# EasyEDA Pro project PBMCU_C_Hall.epro, board PCB1_1
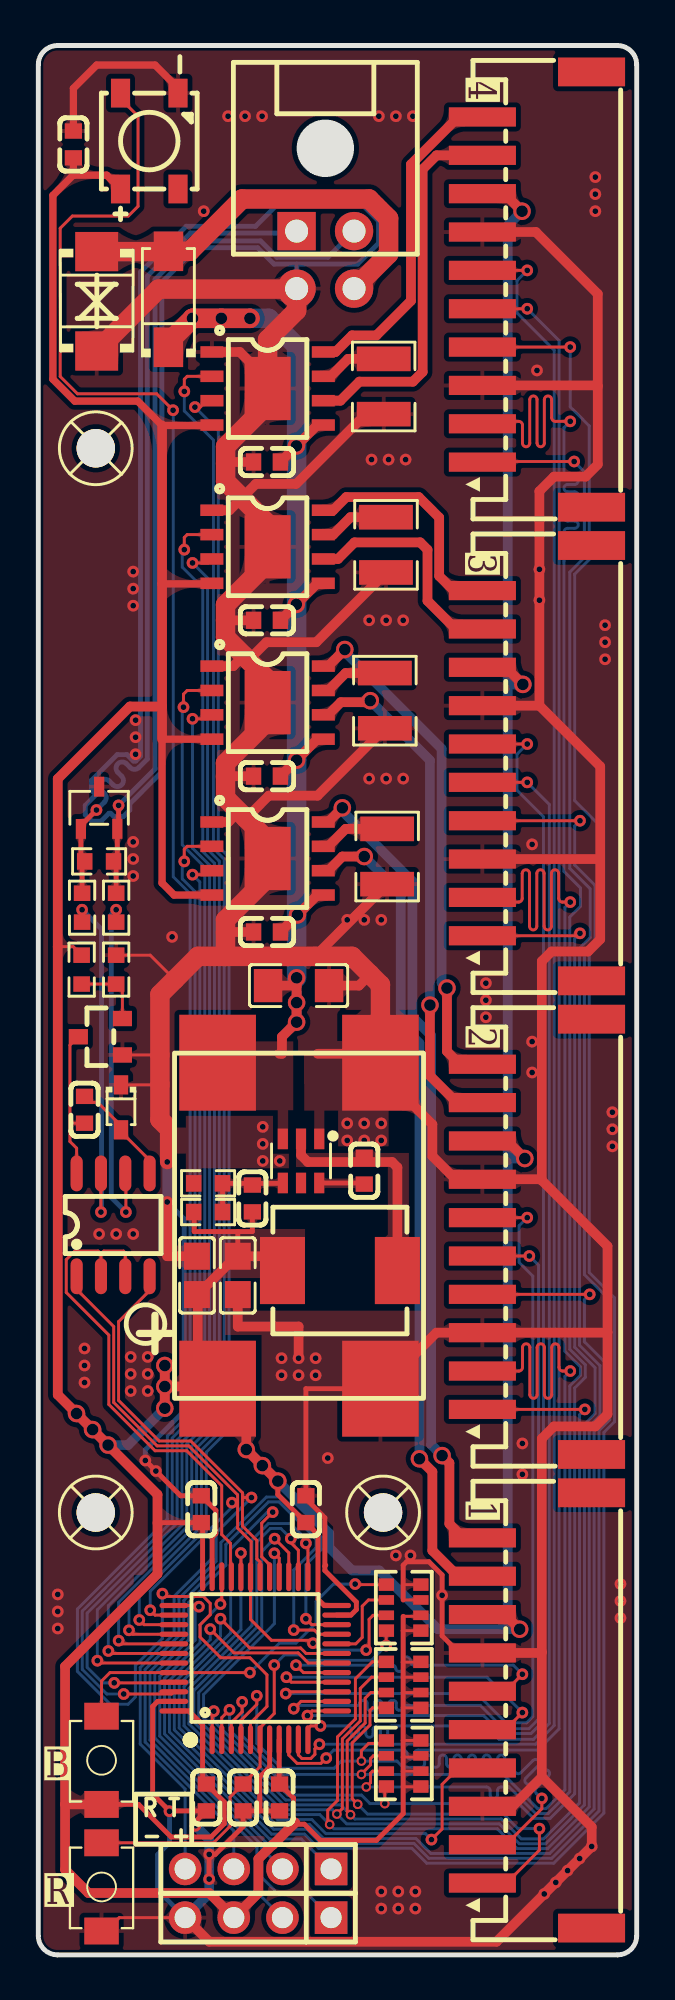
[diagram p2: board, top side]
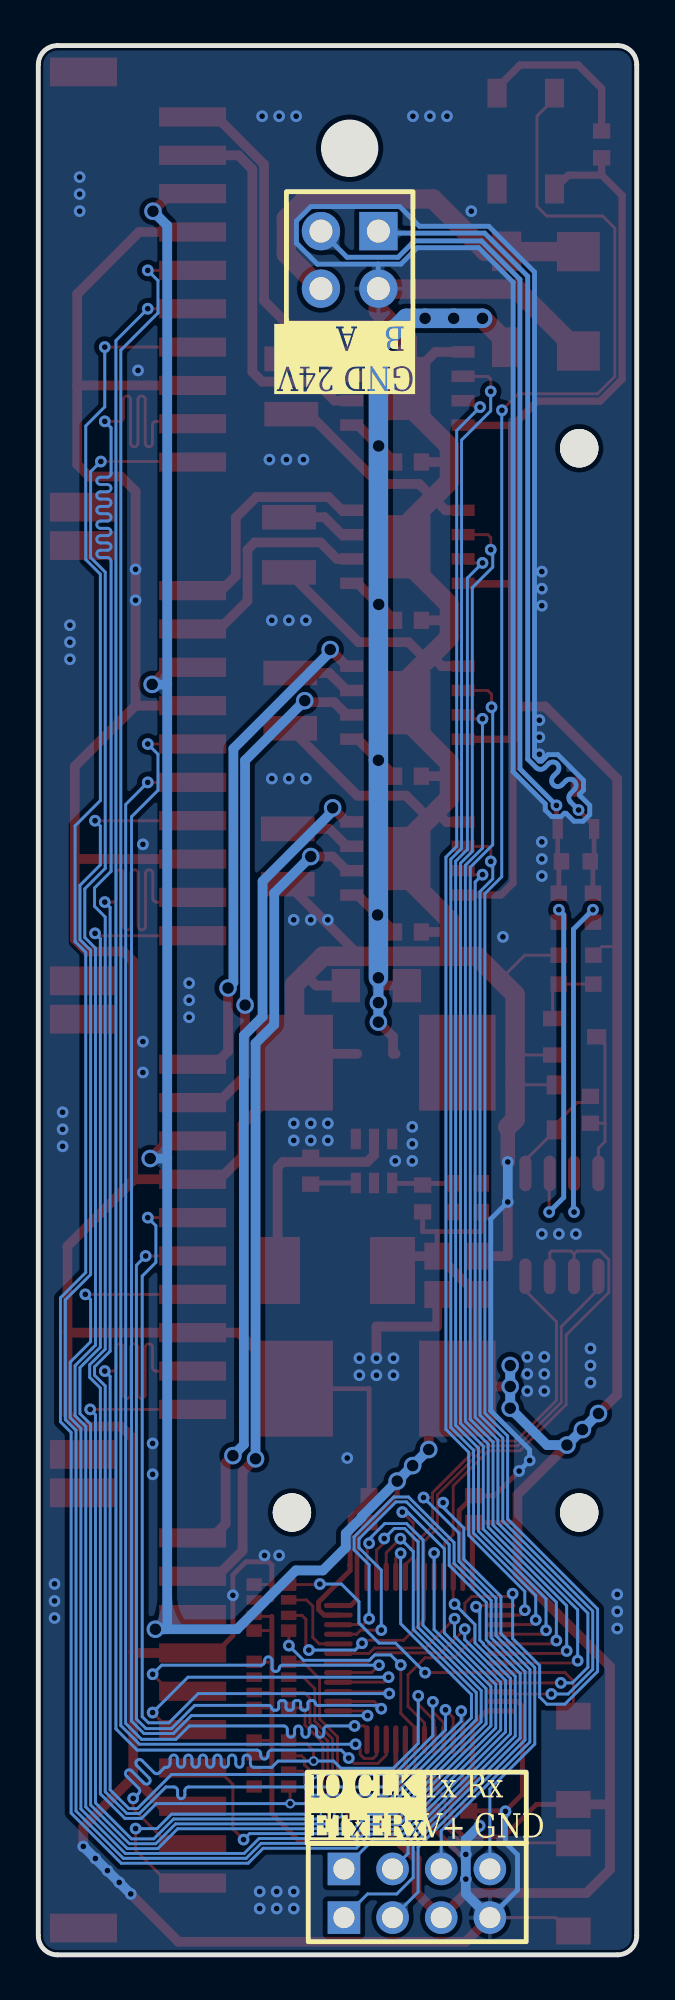
[diagram p3: board, bottom side, seen from below]

Outline 31.24 x 99.57 mm; copper layers: Top Layer, Bottom Layer. Coordinates in mm from the lower left corner of the outline.
Outline path: 0,98.57 0,1 arc(0.29,0.29) 1,0 30.24,0 arc(30.95,0.29) 31.24,1 31.24,98.57 arc(30.95,99.28) 30.24,99.57 1,99.57 arc(0.29,99.28) 0,98.57
Stack: Top Layer 0.035mm / Dielectric1 1.51mm FR4 er 4.5 / Bottom Layer 0.035mm

## Design rules (mm)
net RS485_B: RS485
net RS485_A: RS485
template: 自定义配置
spacing copperThickness1oz (default): track to track 0.102, other pairs 0 to 0.3
spacing copperThickness2oz: track to track 0.203, other pairs 0.152 to 0.3
track width copperThickness1oz (default): min 0.127, default 0.254, max 2.54
track width copperThickness2oz: min 0.203, default 0.254, max 2.54
differential pair differentialPair (default): width min 0.127, default 0.254, max 2.54; gap min 0.152, default 0.152
via viaSize (default): diameter min 0.5, default 0.61, max 10; hole min 0.3, default 0.305, max 6.3

## Placement (name value [footprint] x y rotation side)
C1  47pF  [C0603]  11.18 39.45 270 top
C2  22uF  [C1206]  13.59 50.55 180 top
C3  22uF  [C0805]  8.28 35.43 270 top
C4  22uF  [C0805]  10.41 35.43 90 top
C5  100nF  [C0603]  17.02 40.89 90 top
C6  100nF  [C0603]  10.69 8.21 90 top
C7  100nF  [C0603]  12.6 8.21 90 top
C8  100nF  [C0603]  8.77 8.21 90 top
C9  100nF  [C0603]  13.97 23.24 270 top
C10  100nF  [C0603]  8.51 23.24 270 top
C11  100nF  [C0603]  1.83 94.41 270 top
C13  100nF  [C0603]  11.94 77.85 0 top
C14  100nF  [C0603]  11.94 61.47 0 top
C15  100nF  [C0603]  11.94 69.6 0 top
C16  100nF  [C0603]  11.94 53.34 0 top
C17  100nF  [C0603]  2.41 44.07 270 top
CN1  HC-MX3.0-2*2AW  [CONN-TH_4P-P3.00_HC-MX3.0-2X2AW_1]  14.99 88.39 180 top
CN2  2.0-10P WT  [CONN-SMD_10P-P2.00_2.0-10P-WT]  26.03 86.85 90 top
CN3  2.0-10P WT  [CONN-SMD_10P-P2.00_2.0-10P-WT]  26.03 62.15 90 top
CN4  2.0-10P WT  [CONN-SMD_10P-P2.00_2.0-10P-WT]  26.03 37.45 90 top
CN5  2.0-10P WT  [CONN-SMD_10P-P2.00_2.0-10P-WT]  26.03 12.75 90 top
D1  SMBJ24CA  [SMB_L4.6-W3.6-LS5.3-BI]  3.05 86.23 90 top
D2  PSM712-LF-T7  [SOT-23-3_L3.0-W1.7-P0.95-LS2.9-BR]  3.18 59.82 270 top
D3  1N5819WS  [SOD-323_L1.8-W1.3-LS2.5-RD]  4.32 44.2 270 top
D4  SS54  [SMA_L4.4-W2.8-LS5.4-R-RD]  6.79 86.34 90 top
H1  -  [HDR-TH_4P-P2.54-V-M]  11.48 1.94 180 top
H2  -  [HDR-TH_4P-P2.54-V-M]  11.48 4.48 180 top
L1  10uH  [IND-SMD_L7.3-W6.8]  15.75 35.69 180 top
LED1  XL-5050RGBC-WS2812B  [LED-SMD_4P-L5.0-W5.0-BL_XL-5050RGBC]  5.79 94.59 0 top
Q1  AO3401A  [SOT-23_L2.9-W1.3-P1.90-LS2.4-BR]  3.24 47.88 0 top
R1  68kΩ  [R0603]  8.86 38.74 180 top
R2  15kΩ  [R0603]  8.86 40.23 0 top
R3  680mΩ  [R1210]  18.03 81.79 270 top
R4  680mΩ  [R1210]  18.15 73.53 270 top
R5  680mΩ  [R1210]  18.09 65.41 270 top
R6  680mΩ  [R1210]  18.21 57.28 270 top
R7  10Ω  [R0603]  2.29 54.61 90 top
R8  10Ω  [R0603]  4.06 54.61 90 top
R9  120Ω  [R0603]  3.18 57.02 180 top
R10  470Ω  [R0603]  4.06 51.38 270 top
R11  10Ω  [R0603]  2.26 51.38 270 top
RN1  10kΩ  [RES-ARRAY-SMD_0603-8P-L3.2-W1.6-BL]  19.07 9.98 270 top
RN2  10kΩ  [RES-ARRAY-SMD_0603-8P-L3.2-W1.6-BL]  19.07 14.08 270 top
RN3  10kΩ  [RES-ARRAY-SMD_0603-8P-L3.2-W1.6-BL]  19.07 18.11 270 top
SW1  B3U-1000P  [KEY-SMD_B3U-1000PM]  3.3 3.56 270 top
SW2  B3U-1000P  [KEY-SMD_B3U-1000PM]  3.3 10.16 270 top
TP1  -  [M2螺丝]  3 78.57 0 top
TP2  -  [M2螺丝]  3 23.07 0 top
TP3  -  [M2螺丝]  18 23.07 0 top
U1  TPS54202DDCR  [SOT-23-6_L2.9-W1.6-P0.95-LS2.8-BL]  13.72 41.4 180 top
U2  CH32V203C8T6  [LQFP-48_L7.0-W7.0-P0.50-LS9.0-BL]  11.33 15.47 0 top
U3  -  [SMD 方焊盘 4*5]  9.36 29.53 180 top
U4  -  [SMD 方焊盘 4*5]  9.36 46.53 180 top
U5  -  [SMD 方焊盘 4*5]  17.86 46.53 0 top
U6  -  [SMD 方焊盘 4*5]  17.86 29.53 0 top
U7  TP75176E-SR  [SOP-8_L4.9-W3.9-P1.27-LS6.0-BL]  3.91 38.07 0 top
U8  AT8236  [ESOP-8_L4.9-W3.9-P1.27-LS6.0-BL-EP]  11.97 81.68 270 top
U9  AT8236  [ESOP-8_L4.9-W3.9-P1.27-LS6.0-BL-EP]  11.97 73.43 270 top
U10  AT8236  [ESOP-8_L4.9-W3.9-P1.27-LS6.0-BL-EP]  11.97 65.3 270 top
U11  AT8236  [ESOP-8_L4.9-W3.9-P1.27-LS6.0-BL-EP]  11.97 57.17 270 top

## Footprints (pads in the part's own frame, mm; a bottom-side part is the same pattern mirrored in y, then rotated)
C0603
  rect 0.8x0.9 smd: 1(-0.7,0) 2(0.7,0)
C0805
  rect 1.41x1.35 smd: 1(-1,0) 2(1,0)
C1206
  rect 1.485x1.728 smd: 1(-1.593,0) 2(1.593,0)
CONN-SMD_10P-P2.00_2.0-10P-WT
  rect 1x3.5 smd: 1(-9,2.85) 2(-7,2.85) 3(-5,2.85) 4(-3,2.85) 5(-1,2.85) 6(1,2.85) 7(3,2.85) 8(5,2.85) 9(7,2.85) 10(9,2.85)
  rect 1.5x3.5 smd: 11(11.35,-2.85) 12(-11.35,-2.85)
CONN-TH_4P-P3.00_HC-MX3.0-2X2AW_1
  rect 2x2 hole 1.2: 1(1.5,-1.5)
  round 2 hole 1.2: 2(1.5,1.5) 3(-1.5,-1.5) 4(-1.5,1.5)
ESOP-8_L4.9-W3.9-P1.27-LS6.0-BL-EP
  rect 0.6x1.2 smd: 1(-1.905,-2.909) 2(-0.635,-2.909) 3(0.635,-2.909) 4(1.905,-2.909) 5(1.905,2.909) 6(0.635,2.909) 7(-0.635,2.909) 8(-1.905,2.909)
  rect 3.3x2.4 smd: 9(0,0)
HDR-TH_4P-P2.54-V-M
  rect 1.7x1.7 hole 1.1: 1(-3.81,0)
  round 1.7 hole 1.1: 2(-1.27,0) 3(1.27,0) 4(3.81,0)
IND-SMD_L7.3-W6.8
  rect 2.35x3.5 smd: 1(-3,0) 2(3,0)
KEY-SMD_B3U-1000PM
  rect 1.4x1.8 smd: 1(-2.286,0) 2(2.314,0)
LED-SMD_4P-L5.0-W5.0-BL_XL-5050RGBC
  rect 1x1.5 smd: 1(-1.5,-2.5) 2(1.5,-2.5) 3(1.5,2.5) 4(-1.5,2.5)
LQFP-48_L7.0-W7.0-P0.50-LS9.0-BL
  oval 0.27x1.5 smd: 1(-2.75,-4.25) 2(-2.25,-4.25) 3(-1.75,-4.25) 4(-1.25,-4.25) 5(-0.75,-4.25) 6(-0.25,-4.25) 7(0.25,-4.25) 8(0.75,-4.25) 9(1.25,-4.25) 10(1.75,-4.25) 11(2.25,-4.25) 12(2.75,-4.25) 25(2.75,4.25) 26(2.25,4.25) 27(1.75,4.25) 28(1.25,4.25) 29(0.75,4.25) 30(0.25,4.25) 31(-0.25,4.25) 32(-0.75,4.25) 33(-1.25,4.25) 34(-1.75,4.25) 35(-2.25,4.25) 36(-2.75,4.25)
  oval 1.5x0.27 smd: 13(4.25,-2.75) 14(4.25,-2.25) 15(4.25,-1.75) 16(4.25,-1.25) 17(4.25,-0.75) 18(4.25,-0.25) 19(4.25,0.25) 20(4.25,0.75) 21(4.25,1.25) 22(4.25,1.75) 23(4.25,2.25) 24(4.25,2.75) 37(-4.25,2.75) 38(-4.25,2.25) 39(-4.25,1.75) 40(-4.25,1.25) 41(-4.25,0.75) 42(-4.25,0.25) 43(-4.25,-0.25) 44(-4.25,-0.75) 45(-4.25,-1.25) 46(-4.25,-1.75) 47(-4.25,-2.25) 48(-4.25,-2.75)
M2螺丝
  round 2 hole 2: 1(0,0)
R0603
  rect 0.806x0.864 smd: 1(-0.753,0) 2(0.753,0)
R1210
  rect 1.282x2.808 smd: 1(-1.441,0) 2(1.441,0)
RES-ARRAY-SMD_0603-8P-L3.2-W1.6-BL
  rect 0.65x0.8 smd: 1(-1.2,-0.9) 4(1.2,-0.9) 5(1.2,0.9) 8(-1.2,0.9)
  rect 0.5x0.8 smd: 2(-0.4,-0.9) 3(0.4,-0.9) 6(0.4,0.9) 7(-0.4,0.9)
SMA_L4.4-W2.8-LS5.4-R-RD
  rect 2.062x1.539 smd: 1(2.503,0) 2(-2.503,0)
SMB_L4.6-W3.6-LS5.3-BI
  rect 2.047x2.241 smd: 1(-2.591,0) 2(2.591,0)
SMD 方焊盘 4*5
  rect 4x5 smd: 1(0,0)
SOD-323_L1.8-W1.3-LS2.5-RD
  rect 1x0.75 smd: 1(-1.173,0) 2(1.173,0)
SOP-8_L4.9-W3.9-P1.27-LS6.0-BL
  oval 0.63x1.865 smd: 1(-1.905,-2.683) 2(-0.635,-2.683) 3(0.635,-2.683) 4(1.905,-2.683) 5(1.905,2.683) 6(0.635,2.683) 7(-0.635,2.683) 8(-1.905,2.683)
SOT-23-3_L3.0-W1.7-P0.95-LS2.9-BR
  rect 1.038x0.532 smd: 1(1.101,-0.95) 2(1.101,0.95) 3(-1.101,0)
SOT-23-6_L2.9-W1.6-P0.95-LS2.8-BL
  rect 0.532x1.072 smd: 1(-0.95,-1.149) 2(0,-1.149) 3(0.95,-1.149) 4(0.95,1.149) 5(0,1.149) 6(-0.95,1.149)
SOT-23_L2.9-W1.3-P1.90-LS2.4-BR
  rect 1x0.8 smd: 1(1.15,-0.95) 2(1.15,0.95) 3(-1.15,0)

## Nets
As in the schematic.

Pads without a net: CN2 11 12; CN3 11 12; CN4 11 12; CN5 11 12; LED1 2; TP1 1; TP2 1; TP3 1; U1 5

## Via types
v1: diameter 0.914, hole 0.61, Top Layer to Bottom Layer, 28 vias
v2: diameter 1.016, hole 0.61, Top Layer to Bottom Layer, 3 vias
v3: diameter 0.61, hole 0.305, Top Layer to Bottom Layer, 182 vias
v4: diameter 0.5, hole 0.3, Top Layer to Bottom Layer, 8 vias

## Routing (per net, layer and track width the routed paths; a pad name or vN(x,y) marks a point on that pad's centre or on a via; arc(x,y) is an arc through that point)
3.3V: length 344.3
  Top Layer w0.152: R11.1 1.82,52.58 1.02,52.58 ; 19.97,9.58 19.05,9.58 19.05,9.58 ; RN1.5 19.96,8.76 19.05,8.76 ; 19.05,11.18 19.05,11.18 19.97,11.18 ; RN3.6 19.92,17.65 19.05,17.65 ; RN3.5 19.05,16.91 19.05,16.9 ; 19.05,15.27 19.96,15.27 RN2.8 ; RN2.5 19.07,12.88 19.05,12.9 ; 1.4,7.85 1.4,7.84 ; RN2.6 19.07,13.68 19.05,13.66 ; RN2.7 19.09,14.48 19.05,14.44 ; 19.05,10.31 19.91,10.31 RN1.7
  Top Layer w0.254: 6.22,22.53 6.23,22.54 C10.2 8.58,22.47 U2.36 ; v1(12.5,24.71) 12.5,24.01 C9.2 14.6,21.91 14.6,18.54 14.93,18.22 U2.24 ; U2.48 7.86,12.72 8.58,12 U2.1 8.58,9.1 C8.2 9.71,7.97 9.71,6.84 9.02,6.15 6.93,6.15 5.24,7.85 SW2.2 ; 8.14,38.74 8.14,37.72 11.18,37.72 11.18,38.67 ; 19.05,17.65 19.05,7.37 17.65,5.97 14.73,5.97 13.89,6.81 13.33,6.81 13.33,8.18 C7.2 12.58,8.93 U2.9 ; C4.2 10.41,37.72
  Top Layer w0.381: C11.2 1.83,92.82 1.82,92.81 ; 1.82,92.81 0.76,91.75 0.76,82.17 1.91,81.03 5.19,81.03 6.46,79.76 9.04,79.76 U8.4 ; 1.82,92.81 3.57,92.81 4.29,92.09 ; U9.4 9.03,71.5 6.46,71.5 ; U10.4 6.46,63.4 6.46,63.39 6.46,55.9 7.09,55.27 U11.4
  Top Layer w0.508: 8.71,29.64 8.83,29.53 U3.1 ; 8.71,29.64 8.33,30.03 8.33,34.43 10.33,36.43 C4.2 12.75,36.43 L1.2 ; 8.71,29.64 9.25,29.64 U3.1 ; 8.71,29.64 v1(6.6,29.64) ; CN5.8 24.37,17.75 v1(25.13,16.98) ; SW2.2 1.4,7.85 ; 6.46,65.1 4.79,65.1 1.02,61.33 1.02,29.21 v1(2,28.23) v1(2.83,27.39) v1(3.64,26.59) 6.22,24 6.22,19.87 1.4,15.04 1.4,4.45 2.62,3.22 8.92,3.22 H1.3 11.49,3.22 11.49,5 12.23,5.74 12.25,5.74 13.42,6.9 ; 6.46,65.1 6.46,79.76 ; 6.46,65.1 6.46,63.39 ; v1(25.4,41.53) 24.48,42.45 CN4.8 ; CN3.8 24.41,67.15 v1(25.3,66.25) ; U3.1 10.86,28.03 v1(10.86,26.35) v1(11.7,25.51) v1(12.5,24.71) ; v1(25.26,90.93) 24.34,91.85 23.29,91.85 ; v1(6.6,30.73) v1(6.6,29.64) ; v1(6.6,29.64) v1(6.6,28.51)
  Bottom Layer w0.508: 24.51,41.59 24.51,66.24 ; 24.51,41.59 24.51,16.98 ; 24.51,41.59 24.57,41.53 v1(25.4,41.53) ; 24.51,66.24 24.51,90.18 v1(25.26,90.93) ; 24.51,66.24 25.29,66.24 v1(25.3,66.25) ; 24.51,16.98 20.87,16.98 17.8,20.05 16.38,20.05 15.19,21.24 15.19,21.98 14.35,22.82 14.35,22.86 v1(12.5,24.71) v1(11.7,25.51) v1(10.86,26.35) ; 24.51,16.98 v1(25.13,16.98) ; v1(2,28.23) v1(2.83,27.39) v1(3.64,26.59) 4.68,26.59 v1(6.6,28.51) v1(6.6,29.64) v1(6.6,30.73)
24V: length 64.4
  Top Layer w0.508: 12.59,46.99 12.72,46.99 12.72,47.88 v1(13.49,48.64) v1(13.49,49.66) 13.49,50.55 ; C13.2 v1(13.47,78.69) 14.57,79.78 U8.5 ; C16.2 v1(13.53,54.23) 14.57,55.27 U11.5 ; 14.88,71.52 14.57,71.52 v1(13.47,70.43) C15.2 ; 13.49,50.55 v1(13.49,50.95) ; 13.49,50.55 C2.2 ; U10.5 14.57,63.4 12.64,61.47
  Top Layer w1.016: v2(11.05,85.34) v2(9.56,85.34) v2(8.05,85.34) 6.79,84.09 D4.2
  Bottom Layer w0.508: v1(13.49,50.95) v1(13.49,49.66) v1(13.49,48.64)
  Bottom Layer w1.016: v1(13.49,50.95) v1(13.49,62.3) 13.49,83.89 12.03,85.34 v2(11.05,85.34) v2(9.56,85.34) v2(8.05,85.34)
GND: length 517.7
  Top Layer w0.152: D3.1 6.33,45.37 6.35,45.39 ; Q1.1 6.33,46.93 6.35,46.91 ; 7.12,50.85 5.84,52.13 R10.1 ; RN3.7 19.05,18.51 ; 19.05,19.31 RN3.8 ; H1.4 4.23,1.94 3.53,1.24 SW1.2
  Top Layer w0.254: U2.47 6.23,13.22 5.97,12.95 5.97,8.38 6.84,7.51 C8.1 8.2,6.94 v3(8.2,6.73) ; v3(5.59,25.78) v3(6.14,25.23) 7.43,23.94 C10.1 9.27,23.18 9.27,21.97 9.08,21.78 U2.35 ; 14.96,20.27 14.96,20.04 16.61,18.4 16.61,18 16.32,17.72 U2.23 ; 14.96,20.27 14.96,22.79 13.97,23.79 C9.1 13.97,29.53 U6.1 ; 14.96,20.27 15.01,20.32 ; U2.8 12.08,9.79 11.56,9.27 11.56,7.51 ; CN5.7 21.97,15.75 21.08,16.64 v3(21.08,18.75) 21.08,19.81 20.39,20.5 19.23,20.5 19.05,20.32 19.05,18.51 ; v3(8.92,3.95) v3(8.92,5.24) 9.24,5.24 10.69,6.69 C6.1 11.56,7.51 ; 11.56,7.51 C7.1
  Top Layer w0.381: LED1.3 7.29,97.36 6.1,98.55 3.05,98.55 1.83,97.34 C11.1
  Top Layer w0.508: 29.34,57.07 29.34,61.98 26.17,65.15 26.16,65.15 ; 29.34,57.07 29.26,57.15 CN3.3 ; 29.34,57.07 29.34,52.96 28.7,52.32 26.8,52.32 26.29,51.82 26.29,40.39 ; 29.72,32.47 29.7,32.45 CN4.3 20.78,32.45 U6.1 ; 29.72,32.47 29.72,36.96 26.29,40.39 ; 29.72,32.47 29.72,28.19 29.08,27.56 26.92,27.56 26.29,26.92 26.29,15.78 ; R3.2 17.1,80.35 13.46,76.71 11.35,76.71 9.98,75.33 U9.1 ; 26.29,9.27 28.89,6.67 v3(28.89,5.65) v3(28.26,5.02) v3(27.63,4.39) v3(27.02,3.78) v3(26.42,3.18) 23.93,0.68 8.92,0.68 H1.4 ; 26.29,9.27 24.76,7.75 CN5.3 ; 26.29,9.27 26.29,15.78 ; U10.1 10.18,67.21 10.73,67.76 ; 29.21,81.8 29.21,77.72 28.57,77.09 26.92,77.09 26.16,76.33 v3(26.16,72.26) v3(26.16,70.64) 26.16,65.15 ; 29.21,81.8 29.17,81.85 CN2.3 ; 29.21,81.8 29.21,86.61 25.98,89.85 CN2.7 ; 10.97,67.52 11.91,68.45 14.51,68.45 R4.2 ; 26.29,15.78 26.25,15.75 CN5.7 ; C16.1 9.81,53.34 9.77,53.3 ; 11.97,82.13 10.52,83.59 U8.1 ; 10.29,59.44 9.93,59.08 U11.1 ; R6.2 14.45,52.07 ; R5.2 14.58,60.45 12.03,60.45 10.84,59.26 ; 26.16,65.15 CN3.7 ; v3(13.59,31.12) 13.59,32.77 10.41,32.77 C4.1 ; 26.29,40.39 26.23,40.45 CN4.7 21.78,40.45 20.57,41.66 20.57,43.31 17.86,46.02 U5.1 17.4,46.99 14.59,46.99 ; C14.1 9.79,61.47 9.78,61.45 ; 8.33,36.43 6.73,36.43 v3(6.73,39.26) ; 9.78,77.76 9.87,77.85 C13.1 ; C15.1 9.78,69.6 ; C2.1 16.74,50.55 17.32,51.13
  Top Layer w0.762: 6.73,43.18 v3(6.73,41.35)
  Top Layer w1.016: 6.73,43.18 6.35,43.56 6.35,50.08 7.12,50.85 8.34,52.07 9.77,52.07 ; D1.1 6.27,86.87 13.46,86.87 CN1.2 13.49,85.75 11.97,84.24 U8.9 11.97,80.85 9.78,78.66 9.78,76.84 11.97,74.64 U9.9 11.97,72.6 9.78,70.41 9.78,68.71 11.97,66.52 11.97,64.34 9.78,62.15 9.78,60.33 11.97,58.14 11.97,56.16 9.77,53.97 9.77,52.07 ; U5.1 17.86,50.59 16.38,52.07 9.77,52.07
  Bottom Layer w0.254: 4.85,62.37 4.96,62.26 5.09,62.26 5.33,62.5 5.33,87.76 7.72,90.15 11.34,90.15 12.37,91.17 17.02,91.17 17.76,90.42 17.76,89.27 16.67,88.17 13.5,88.17 ; H1.4 6.22,3.38 6.22,5.22 6.85,5.85 ; v3(6.85,7.49) 6.85,5.85 ; 6.85,5.85 6.86,5.84 ; 13.5,88.17 13.5,86.9 CN1.2 ; 13.5,88.17 12.31,88.17 11.45,89.03 8.25,89.03 6.45,87.22 6.45,61.7 4.78,60.02 4.78,59.7 4.43,59.36 3.95,59.36 3.78,59.53 3.69,59.53 3.28,59.12 2.79,59.12 2.45,59.46 2.45,59.94 2.99,60.49 2.99,60.52 2.78,60.74 2.78,61.25 4.12,62.59 4.63,62.59 4.85,62.37 ; v3(6.14,25.23) v3(5.59,25.78) 5.59,26.34 7.62,28.37 7.62,38.37 v3(6.73,39.26)
  Bottom Layer w0.508: v3(28.89,5.65) v3(28.26,5.02) v3(27.63,4.39) v3(27.02,3.78) v3(26.42,3.18) ; v3(8.2,6.73) 8.92,6.01 v3(8.92,5.24) v3(8.92,3.95) 8.92,3.2 H1.4 ; v3(6.73,41.35) v3(6.73,39.26)
  vias: v3(1.02,18.8) v3(1.02,17.91) v3(1.02,17.02) v3(2.41,31.62) v3(2.41,30.73) v3(2.41,29.84) v3(3.18,37.59) v3(4.06,37.59) v3(4.82,31.18) v3(4.82,30.29) v3(4.82,29.4) v3(4.95,72.14) v3(4.95,71.25) v3(4.95,70.36) v3(4.95,58.04) v3(4.95,57.15) v3(4.95,56.26) v3(4.95,37.59) v3(5.08,64.39) v3(5.08,63.5) v3(5.08,62.61) v3(5.71,31.18) v3(5.71,30.29) v3(5.71,29.4) v3(6.99,53.09) v3(8.64,90.93) v3(9.91,95.89) v3(10.79,95.89) v3(11.68,95.89) v3(11.72,43.18) v3(11.72,42.29) v3(11.72,41.4) v3(12.61,41.4) v3(12.7,31.12) v3(12.7,30.23) v3(13.59,30.23) v3(14.48,31.12) v3(14.48,30.23) v3(15.11,25.91) v3(16.13,53.98) v3(16.13,43.36) v3(16.13,42.47) v3(17.02,53.98) v3(17.02,43.36) v3(17.02,42.47) v3(17.27,69.6) v3(17.27,61.34) v3(17.4,77.98) v3(17.78,95.89) v3(17.91,53.98) v3(17.9,43.36) v3(17.9,42.47) v3(17.91,3.3) v3(17.91,2.41) v3(18.16,69.6) v3(18.16,61.34) v3(18.29,77.98) v3(18.67,95.89) v3(18.67,20.83) v3(18.8,3.3) v3(18.8,2.41) v3(19.05,69.6) v3(19.05,61.34) v3(19.18,77.98) v3(19.43,20.83) v3(19.56,95.89) v3(19.69,3.3) v3(19.69,2.41) v3(23.37,50.67) v3(23.37,49.78) v3(23.37,48.9) v3(25.27,26.67) v3(25.27,25.06) v3(25.78,57.91) v3(25.78,47.63) v3(25.78,46.01) v3(26.03,82.63) v3(29.08,92.71) v3(29.08,91.82) v3(29.08,90.93) v3(29.59,69.34) v3(29.59,68.45) v3(29.59,67.56) v3(29.97,43.94) v3(29.97,43.05) v3(29.97,42.16) v3(30.4,19.34) v3(30.4,18.45) v3(30.4,17.57)
BOOT0: length 19.5
  Top Layer w0.152: RN3.1 16.57,19.31 v3(16.54,19.34) ; SW2.1 3.3,14.28 3.74,14.72 U2.44 v3(11.05,14.72)
  Bottom Layer w0.152: v3(16.54,19.34) 15.41,19.34 14.5,18.43 14.5,17.31 13.45,16.26 12.59,16.26 v3(11.05,14.72)
BOOT1: length 4.5
  Top Layer w0.152: U2.20 16.57,16.22 16.91,16.56 16.91,18.18 17.24,18.51 RN3.2
EXIT_RX: length 37.4
  Top Layer w0.152: v3(13.97,17.53) 14.28,17.22 U2.22
  Bottom Layer w0.152: H1.2 11.41,3.27 11.41,5.62 5.83,11.2 5.83,14.77 7.6,16.54 7.6,18.48 9.54,20.42 9.54,21.5 11.91,23.88 12.68,23.88 14.76,21.8 14.76,21.14 14.73,21.11 14.73,21.1 13.97,20.34 v3(13.97,17.53)
EXIT_TX: length 39.7
  Top Layer w0.152: v3(13.34,16.94) 14.41,16.94 14.63,16.72 U2.21
  Bottom Layer w0.152: H1.1 14.05,3.18 12.53,3.18 11.67,4.03 11.67,5.73 6.08,11.31 6.08,14.67 7.85,16.44 7.85,18.38 9.79,20.32 9.79,21.4 12.02,23.62 12.57,23.62 14.48,21.72 14.48,21.71 14.5,21.68 14.5,21.24 14.48,21.22 14.48,21.21 13.34,20.07 v3(13.34,16.94)
K_ONLINE1: length 94.4
  Top Layer w0.152: CN2.6 v3(25.53,87.85) ; U2.11 13.58,10.43 13.76,10.24 14.23,10.24 14.44,10.45 14.44,10.75 v3(14.68,10.98)
  Bottom Layer w0.152: v3(25.53,87.85) 24.99,87.31 24.99,85.62 26.93,83.68 26.93,11.96 25.96,10.98 14.68,10.98
K_ONLINE2: length 68.7
  Top Layer w0.152: CN3.6 v3(25.53,63.15) ; U2.13 14.29,12.72 v3(14.05,12.48)
  Bottom Layer w0.152: v3(14.05,12.48) 23.25,12.48 24.19,11.54 25.73,11.54 26.38,12.19 26.38,59.35 24.99,60.73 24.99,62.61 v3(25.53,63.15)
K_ONLINE3: length 45.2
  Top Layer w0.152: CN4.6 v3(25.53,38.45) ; v3(12.92,13.62) 13.01,13.72 U2.15
  Bottom Layer w0.152: v3(12.92,13.62) 22.89,13.62 24.42,12.1 25.49,12.1 25.82,12.42 25.82,35.4 25.1,36.11 25.1,38.02 v3(25.53,38.45)
K_ONLINE4: length 17.8
  Top Layer w0.152: U2.17 13.84,14.72 v3(13.46,15.11) ; CN5.6 24.38,13.75 v3(25.27,14.63)
  Bottom Layer w0.152: v3(13.46,15.11) 18.5,15.11 arc(18.62,15.06) 18.66,14.94 arc(18.71,14.83) 18.82,14.78 18.88,14.78 arc(19,14.83) 19.04,14.94 19.04,15.35 arc(19.23,15.54) 19.42,15.35 19.42,15.3 arc(19.48,15.16) 19.61,15.11 24.8,15.11 v3(25.27,14.63)
K_PULL1: length 93.6
  Top Layer w0.152: CN2.5 v3(25.53,85.85) ; U2.10 13.08,10.42 13.51,9.99 14.76,9.99 v3(15.03,10.26)
  Bottom Layer w0.152: v3(25.53,85.85) 27.19,84.18 27.19,11.78 26.08,10.68 19.82,10.68 arc(19.69,10.62) 19.63,10.49 19.63,10.4 arc(19.44,10.2) 19.25,10.4 19.25,10.49 arc(19.19,10.62) 19.06,10.68 15.42,10.68 15.03,10.29 v3(15.03,10.26)
K_PULL2: length 68.4
  Top Layer w0.152: CN3.5 v3(25.53,61.15) ; U2.12 14.08,11.79 14.22,11.94 v3(14.73,11.94)
  Bottom Layer w0.152: v3(25.53,61.15) 26.68,59.99 26.68,12.07 25.85,11.24 24.06,11.24 23.36,11.94 18.43,11.94 arc(18.3,11.88) 18.24,11.75 18.24,11.53 arc(18.05,11.34) 17.86,11.53 17.86,11.75 arc(17.67,11.94) 17.48,11.75 17.48,11.53 arc(17.29,11.34) 17.1,11.53 17.1,11.75 arc(16.91,11.94) 16.72,11.75 16.72,11.53 arc(16.53,11.34) 16.34,11.53 16.34,11.75 arc(16.28,11.88) 16.15,11.94 v3(14.73,11.94)
K_PULL3: length 44.9
  Top Layer w0.152: 23.29,36.45 v3(25.64,36.45) ; v3(13.34,12.84) 13.72,13.22 U2.14
  Bottom Layer w0.152: v3(13.34,12.84) 13.51,13.01 16.66,13.01 arc(16.75,13.05) 16.78,13.13 arc(16.82,13.22) 16.91,13.26 17.04,13.26 arc(17.13,13.22) 17.17,13.13 17.17,12.89 arc(17.2,12.8) 17.29,12.76 17.42,12.76 arc(17.51,12.8) 17.55,12.89 17.55,13.13 arc(17.58,13.22) 17.67,13.26 17.8,13.26 arc(17.89,13.22) 17.93,13.13 17.93,12.89 arc(17.96,12.8) 18.05,12.76 18.18,12.76 arc(18.27,12.8) 18.31,12.89 18.31,13.13 arc(18.34,13.22) 18.43,13.26 18.57,13.26 arc(18.65,13.22) 18.69,13.13 18.69,12.89 arc(18.73,12.8) 18.81,12.76 18.95,12.76 arc(19.03,12.8) 19.07,12.89 arc(19.11,12.97) 19.19,13.01 23.08,13.01 24.29,11.8 25.62,11.8 26.12,12.3 26.12,35.96 v3(25.64,36.45)
K_PULL4: length 18.3
  Top Layer w0.152: CN5.5 24.38,11.75 v3(25.27,12.63) ; U2.16 13.21,14.22 v3(12.95,14.48)
  Bottom Layer w0.152: v3(12.95,14.48) 23.43,14.48 v3(25.27,12.63)
MCU_RTS: length 26.9
  Top Layer w0.152: U7.3 4.54,36.61 4.44,36.7 3.42,36.7 3.27,36.55 ; 3.27,36.55 U7.2 ; 3.27,36.55 3.12,36.7 1.91,36.7 1.46,36.26 1.46,34.54 3.68,32.32 3.68,28.7 6.1,26.29 7.75,26.29 9.58,24.46 9.58,21.92 10.03,21.46 10.03,19.76 U2.33
MCU_RX: length 54.4
  Top Layer w0.152: v3(17.12,15.89) 17.27,16.05 17.27,17.5 17.48,17.71 RN3.3 ; v3(10.11,23.58) 10.41,23.58 ; 10.41,23.58 10.41,22.26 11.11,21.55 11.11,19.75 U2.31 11.08,17.5 12.17,16.4 14.19,16.4 v3(14.34,16.25) ; 10.41,23.58 10.41,23.99 7.85,26.54 6.2,26.54 3.94,28.81 3.94,32.77 2,34.7 U7.1
  Bottom Layer w0.152: v3(14.34,16.25) 14.7,15.89 v3(17.12,15.89) ; H2.4 7.67,8.65 5.32,10.99 5.32,14.98 7.09,16.75 7.09,18.69 9.03,20.63 9.03,22.26 10.11,23.34 v3(10.11,23.58)
MCU_SCL1: length 128
  Top Layer w0.152: RN2.1 17.44,15.28 16.56,14.4 16.56,12.3 15.62,11.37 15.62,8.05 15.11,7.54 15.11,6.9 v4(15.21,6.8) ; CN2.1 23.22,77.88 v3(27.98,77.88) ; v3(13.97,21.46) 14.08,21.36 U2.25
  Bottom Layer w0.152: v3(13.97,21.46) 13.97,21.68 13.16,22.49 12.01,22.49 11.16,21.63 11.16,17.18 7.87,13.89 7.87,12.05 12.6,7.31 14.7,7.31 v4(15.21,6.8) 15.44,6.58 23.97,6.58 25,5.54 26.59,5.54 28.76,7.71 28.76,27.56 29.32,28.12 29.32,30.73 28.26,31.79 28.26,52.49 28.81,53.05 28.81,55.59 27.75,56.66 27.75,72.11 28.51,72.87 28.51,77.34 v3(27.98,77.88)
MCU_SCL2: length 99.1
  Top Layer w0.152: CN3.1 28.15,53.15 v3(28.28,53.27) ; v3(13.18,21.71) 13.18,21.5 13.58,21.1 U2.26 ; v4(15.59,7.34) 15.87,7.63 15.87,11.26 16.81,12.2 16.81,13.89 17.4,14.48 RN2.2
  Bottom Layer w0.152: v3(28.28,53.27) 28,52.99 28,31.69 29.07,30.62 29.07,28.22 28.51,27.67 28.51,7.82 26.49,5.8 25.11,5.8 24.07,6.83 16.1,6.83 v4(15.59,7.34) 15.36,7.57 12.7,7.57 8.12,12.15 8.12,13.78 11.41,17.07 11.41,21.53 12.12,22.24 12.66,22.24 v3(13.18,21.71)
MCU_SCL3: length 70.4
  Top Layer w0.152: v3(12.34,21.7) 13.08,20.96 U2.27 ; RN2.3 17.36,13.68 17.06,13.38 17.06,12.09 16.13,11.15 16.13,7.48 v4(16.3,7.31) ; CN4.1 v3(28.53,28.45)
  Bottom Layer w0.152: v3(12.34,21.7) 12.11,21.47 12.1,21.47 11.79,21.16 11.79,21.16 11.66,21.03 11.66,16.97 8.37,13.68 8.37,12.26 12.81,7.82 15.79,7.82 v4(16.3,7.31) 16.52,7.09 24.18,7.09 25.21,6.05 26.38,6.05 28.26,7.92 28.26,28.17 v3(28.53,28.45)
MCU_SCL4: length 42.5
  Top Layer w0.152: v4(16.68,7.85) 16.39,8.14 16.39,11.05 17.32,11.98 17.32,12.75 17.45,12.88 RN2.4 ; CN5.1 24.45,3.75 26.16,5.46 v3(26.16,6.58) ; v3(12.32,20.94) 12.58,20.69 U2.28
  Bottom Layer w0.152: v3(26.16,6.58) 25.04,6.58 24.28,7.34 17.19,7.34 v4(16.68,7.85) 16.45,8.08 12.91,8.08 8.63,12.36 8.63,13.57 12.32,17.27 v3(12.32,20.94)
MCU_SDA1: length 118.7
  Top Layer w0.152: RN1.4 18.09,8.7 v4(18.09,7.89) ; v3(9.16,12.71) 9.08,12.63 U2.2 ; v3(27.77,79.97) 26.99,79.97 arc(26.86,80.03) 26.8,80.16 26.8,81.11 arc(26.61,81.3) 26.42,81.11 26.42,78.84 arc(26.23,78.65) 26.04,78.84 26.04,81.11 arc(25.85,81.3) 25.66,81.11 25.66,78.84 arc(25.47,78.65) 25.28,78.84 25.28,79.78 arc(25.22,79.92) 25.09,79.97 23.31,79.97 CN2.2
  Bottom Layer w0.152: v3(27.77,79.97) 27.44,79.64 27.44,77.25 arc(27.5,77.12) 27.63,77.06 28,77.06 arc(28.19,76.87) 28,76.68 27.63,76.68 arc(27.44,76.49) 27.63,76.3 28,76.3 arc(28.19,76.11) 28,75.92 27.63,75.92 arc(27.44,75.73) 27.63,75.54 28,75.54 arc(28.19,75.35) 28,75.16 27.63,75.16 arc(27.44,74.96) 27.63,74.77 28,74.77 arc(28.19,74.58) 28,74.39 27.63,74.39 arc(27.44,74.2) 27.63,74.01 28,74.01 arc(28.19,73.82) 28,73.63 27.63,73.63 arc(27.44,73.44) 27.63,73.25 28,73.25 arc(28.19,73.06) 28,72.87 27.63,72.87 arc(27.5,72.81) 27.44,72.68 27.44,56.5 28.31,55.64 28.31,54.68 27.75,54.12 27.75,31.58 28.56,30.77 28.56,30.12 28,29.56 28,8.4 26.72,7.12 25.86,7.12 25.09,7.89 v4(18.09,7.89) 17.32,7.89 16.87,8.33 13.02,8.33 9.16,12.19 v3(9.16,12.71)
MCU_SDA2: length 92.1
  Top Layer w0.152: 18.17,9.58 17.45,9.58 17.34,9.47 17.34,8.98 v4(17.12,8.76) ; CN3.2 23.43,54.9 25.07,54.9 arc(25.21,54.96) 25.26,55.09 25.26,56.4 arc(25.46,56.59) 25.65,56.4 25.65,53.64 arc(25.84,53.45) 26.03,53.64 26.03,56.4 arc(26.22,56.59) 26.41,56.4 26.41,53.64 arc(26.6,53.45) 26.79,53.64 26.79,56.4 arc(26.98,56.59) 27.17,56.4 27.17,55.09 arc(27.23,54.96) 27.36,54.9 v3(27.77,54.9) ; U2.3 9.58,12.37 v3(9.98,12.78)
  Bottom Layer w0.152: v3(9.98,12.78) 9.98,11.73 12.96,8.76 v4(17.12,8.76) 23.4,8.76 arc(23.53,8.7) 23.59,8.56 23.59,8.33 arc(23.78,8.14) 23.97,8.33 23.97,8.56 arc(24.03,8.7) 24.16,8.76 24.58,8.76 25.96,7.37 26.62,7.37 27.75,8.5 27.75,29.67 28.31,30.22 28.31,30.67 27.49,31.48 27.49,54.62 v3(27.77,54.9)
MCU_SDA3: length 64.5
  Top Layer w0.152: v3(10.64,13.19) 10.64,12.68 10.08,12.11 U2.4 ; v4(16.87,9.41) 16.87,9.43 17.34,9.91 17.34,10.23 17.49,10.38 RN1.2 ; v3(27.77,30.45) 27.38,30.45 arc(27.24,30.5) 27.19,30.64 27.19,31.68 arc(26.99,31.87) 26.8,31.68 26.8,29.21 arc(26.61,29.02) 26.42,29.21 26.42,31.68 arc(26.23,31.87) 26.04,31.68 26.04,29.21 arc(25.85,29.02) 25.66,29.21 25.66,31.68 arc(25.47,31.87) 25.28,31.68 25.28,30.64 arc(25.22,30.5) 25.09,30.45 CN4.2
  Bottom Layer w0.152: v3(27.77,30.45) 27.49,30.17 27.49,8.61 26.51,7.62 26.07,7.62 24.29,9.41 v4(16.87,9.41) 12.66,9.41 10.64,11.43 v3(10.64,13.19)
MCU_SDA4: length 38.2
  Top Layer w0.152: CN5.2 24.41,5.75 26.29,7.62 v3(26.29,8.16) ; U2.5 10.58,12.23 11.41,13.06 v3(11.41,13.51) ; v4(16.87,10.11) 16.87,10.64 17.25,11.03 18.02,11.03 18.17,11.18
  Bottom Layer w0.152: v3(11.41,13.51) 11.41,11.03 12.7,9.73 15.44,9.73 15.82,10.11 v4(16.87,10.11) 18.72,10.11 19.05,9.78 19.98,9.78 arc(20.12,9.83) 20.17,9.97 20.17,10.23 arc(20.36,10.42) 20.55,10.23 20.55,9.97 arc(20.74,9.78) 20.93,9.97 20.93,10.23 arc(21.12,10.42) 21.31,10.23 21.31,9.97 arc(21.5,9.78) 21.69,9.97 21.69,10.23 arc(21.89,10.42) 22.08,10.23 22.08,9.97 arc(22.27,9.78) 22.46,9.97 22.46,10.23 arc(22.65,10.42) 22.84,10.23 22.84,9.97 arc(23.03,9.78) 23.22,9.97 23.22,10.23 arc(23.41,10.42) 23.6,10.23 23.6,9.97 arc(23.79,9.78) 23.98,9.97 23.98,10.23 arc(24.17,10.42) 24.36,10.23 24.36,9.97 arc(24.42,9.83) 24.55,9.78 24.64,9.78 24.92,9.5 arc(25.06,9.44) 25.19,9.5 25.83,10.13 arc(26.1,10.13) 26.1,9.86 25.46,9.23 arc(25.46,8.96) 25.73,8.96 26.37,9.59 arc(26.64,9.59) 26.63,9.32 26,8.69 arc(25.94,8.55) 26,8.42 26.26,8.16 v3(26.29,8.16)
MCU_TX: length 44.4
  Top Layer w0.152: 10.66,23.84 10.66,23.85 v3(11.13,23.85) ; 10.66,23.84 10.66,22.36 11.41,21.61 11.41,20.65 11.58,20.49 U2.30 ; 10.66,23.84 10.66,24.1 7.96,26.8 6.31,26.8 4.19,28.91 4.19,33.02 5.81,34.64 U7.4
  Bottom Layer w0.152: v3(11.13,23.85) 9.28,22 9.28,20.53 7.34,18.59 7.34,16.65 5.58,14.88 5.58,11.1 10.21,6.47 H2.3
MOTOR1_H: length 67.6
  Top Layer w0.152: v3(5.84,17.97) 6.1,17.72 U2.38 ; v3(8.18,80.71) 8.45,80.71 8.79,81.05 U8.3
  Bottom Layer w0.152: v3(5.84,17.97) 5.84,18.95 8.77,21.88 8.77,26.21 9.96,27.4 9.96,57.24 9.4,57.81 9.4,79.49 v3(8.18,80.71)
MOTOR1_HOUT: length 19.8
  Top Layer w0.508: CN2.9 20.79,93.85 20.07,93.12 20.07,82.55 19.56,82.04 16.76,82.04 15.77,81.05 U8.6
MOTOR1_L: length 70.8
  Top Layer w0.152: v3(5.27,17.46) 5.52,17.22 U2.39 ; U8.2 7.77,82.32 7.62,82.17 v3(7.62,81.53)
  Bottom Layer w0.152: v3(7.62,81.53) 7.62,80.52 9.14,78.99 9.14,57.7 9.71,57.14 9.71,27.51 8.52,26.32 8.52,21.99 5.27,18.74 v3(5.27,17.46)
MOTOR1_LOUT: length 17.5
  Top Layer w0.508: CN2.10 21.93,95.85 19.46,93.37 19.46,86.26 17.65,84.46 16.38,84.46 15.52,83.59 U8.8
MOTOR2_H: length 61.7
  Top Layer w0.152: v3(4.73,16.93) 4.94,16.72 U2.40 ; U9.3 8.86,72.59 v3(8.05,72.59)
  Bottom Layer w0.152: v3(4.73,16.93) 4.73,18.57 8.26,22.1 8.26,26.42 9.45,27.61 9.45,57.03 8.84,57.65 8.84,71.8 v3(8.05,72.59)
MOTOR2_HOUT: length 12.1
  Top Layer w0.508: CN3.9 21.79,69.15 20.32,70.61 20.32,73.28 19.94,73.66 16.51,73.66 15.64,72.79 14.88,72.79
MOTOR2_L: length 64.8
  Top Layer w0.152: U9.2 7.77,74.06 7.62,73.91 v3(7.62,73.28) ; v3(4.19,16.39) 4.36,16.22 U2.41
  Bottom Layer w0.152: v3(4.19,16.39) 4.19,18.39 8.01,22.2 8.01,26.53 9.2,27.72 9.2,56.93 8.58,57.54 8.58,71.3 7.52,72.37 7.52,73.17 v3(7.62,73.28)
MOTOR2_LOUT: length 12.4
  Top Layer w0.508: 14.88,75.33 15.39,75.33 16.08,76.02 19.86,76.02 20.93,74.96 20.93,71.91 21.69,71.15 CN3.10
MOTOR3_H: length 55.7
  Top Layer w0.152: v3(3.66,15.85) 3.79,15.72 U2.42 ; v3(8.05,64.46) 8.86,64.46 U10.3
  Bottom Layer w0.152: v3(8.05,64.46) 8.05,57.71 8.94,56.82 8.94,27.82 7.75,26.64 7.75,22.31 3.66,18.21 v3(3.66,15.85)
MOTOR3_HOUT: length 26.9
  Top Layer w0.508: v1(17.33,65.41) 17.25,65.33 15.8,65.33 15.14,64.67 U10.6 ; v1(20.45,49.53) 20.45,45.85 21.85,44.45 CN4.9
  Bottom Layer w0.508: v1(20.45,49.53) 20.45,62.29 v1(17.33,65.41)
MOTOR3_L: length 58.8
  Top Layer w0.152: v3(3.08,15.34) 3.2,15.22 U2.43 ; U10.2 7.77,65.94 7.58,65.74 v3(7.58,65.07)
  Bottom Layer w0.152: v3(7.58,65.07) 7.52,65 7.52,57.89 8.69,56.72 8.69,27.93 7.5,26.74 7.5,22.41 3.08,17.99 v3(3.08,15.34)
MOTOR3_LOUT: length 26.8
  Top Layer w0.508: v1(16,68.07) 15.14,67.21 U10.8 ; CN4.10 22.01,46.45 21.34,47.12 v1(21.34,50.42)
  Bottom Layer w0.508: v1(21.34,50.42) 21.06,50.7 21.06,62.9 16,67.96 v1(16,68.07)
MOTOR4_H: length 49.9
  Top Layer w0.152: U2.45 7.04,14.18 v3(3.96,14.18) ; U11.3 8.85,56.33 v3(8.05,56.33)
  Bottom Layer w0.152: v3(8.05,56.33) 8.43,55.95 8.43,28.03 7.25,26.85 7.25,22.52 2.55,17.82 2.55,14.99 3.36,14.18 v3(3.96,14.18)
MOTOR4_HOUT: length 43.3
  Top Layer w0.508: v1(19.9,25.87) 20.57,25.2 20.57,21.08 21.91,19.75 CN5.9 ; v1(17.02,57.28) 15.88,57.28 15.14,56.54 U11.6
  Bottom Layer w0.508: v1(17.02,57.28) 18.92,55.37 18.92,48.51 19.9,47.54 v1(19.9,25.87)
MOTOR4_L: length 52.4
  Top Layer w0.152: v3(4.46,13.6) 6.96,13.6 U2.46 ; U11.2 7.77,57.81 7.62,57.66 v3(7.62,57.02)
  Bottom Layer w0.152: v3(7.62,57.02) 7.52,56.92 7.52,56.11 8.18,55.45 8.18,28.14 6.99,26.95 6.99,22.62 2.29,17.93 2.29,14.89 3.58,13.6 v3(4.46,13.6)
MOTOR4_LOUT: length 43
  Top Layer w0.508: CN5.10 22.2,21.75 21.46,22.48 21.46,25.65 v1(21.08,26.04) ; v1(15.88,59.82) 15.14,59.08 U11.8
  Bottom Layer w0.508: v1(15.88,59.82) 15.88,59.64 19.53,55.98 19.53,48.92 20.51,47.94 20.51,26.61 v1(21.08,26.04)
NRST: length 23.7
  Top Layer w0.152: v3(12.32,15.11) 12.32,12.59 11.58,11.85 U2.7 11.58,9.81 10.69,8.93 C6.2 10.01,8.23 10.01,6.71 9.14,5.84 SW1.1 ; v3(18.16,16.13) 18.16,16.89 RN3.4
  Bottom Layer w0.152: v3(12.32,15.11) 12.84,15.64 13.68,15.64 13.95,15.36 17.39,15.36 v3(18.16,16.13)
RGB_OUT1: length 123.5
  Top Layer w0.152: v3(8.98,16.99) 10.22,15.75 13.57,15.75 14.1,15.22 U2.18 ; CN2.4 v3(27.77,83.85)
  Bottom Layer w0.152: v3(27.77,83.85) 27.77,80.73 28.76,79.73 28.76,72.77 28,72 28,60.2 29.32,58.88 29.32,52.84 28.76,52.28 28.76,35.58 30.09,34.26 30.09,27.8 29.53,27.25 29.53,7.4 26.91,4.78 20.28,4.78 19.5,5.56 14.63,5.56 13.9,6.3 12.18,6.3 6.85,11.62 6.85,14.31 8.98,16.44 v3(8.98,16.99)
RGB_OUT2: length 97.9
  Top Layer w0.152: v3(9.51,17.53) 11.04,16 13.69,16 13.98,15.72 U2.19 ; CN3.4 v3(28.28,59.15)
  Bottom Layer w0.152: v3(9.51,17.53) 9.51,16.61 7.1,14.21 7.1,11.73 12.28,6.55 14.03,6.55 14.76,5.81 19.61,5.81 20.39,5.03 26.8,5.03 29.27,7.5 29.27,27.35 29.83,27.91 29.83,34.16 28.51,35.48 28.51,52.39 29.07,52.95 29.07,55.77 28,56.84 28,58.87 v3(28.28,59.15)
RGB_OUT3: length 75.8
  Top Layer w0.152: v3(12.24,23.09) 11.66,22.52 11.66,20.76 12.08,20.35 U2.29 ; CN4.4 v3(28.79,34.45)
  Bottom Layer w0.152: v3(28.79,34.45) 28.51,34.17 28.51,31.97 29.58,30.91 29.58,28.01 29.02,27.46 29.02,7.61 26.7,5.29 20.49,5.29 19.71,6.07 14.89,6.07 14.15,6.8 12.39,6.8 7.36,11.84 7.36,14.1 10.04,16.79 10.04,21.18 11.96,23.09 v3(12.24,23.09)
RGB_OUT4: length 32.4
  Top Layer w0.152: v3(20.53,6.01) 21.08,6.57 21.08,8.89 21.94,9.75 CN5.4 ; U2.32 v3(10.58,20.96)
  Bottom Layer w0.152: v3(20.53,6.01) 20.21,6.32 15.01,6.32 14.28,7.06 12.49,7.06 7.61,11.94 7.61,14 10.58,16.96 v3(10.58,20.96)
RS485_A: length 18.9
  Top Layer w0.152: 4.57,40.72 v3(4.57,38.74)
  Top Layer w0.254: U7.6 4.57,40.72 ; R8.1 v3(4.06,54.5)
  Bottom Layer w0.254: v3(4.06,54.5) 3.81,54.25 3.81,39.5 v3(4.57,38.74)
RS485_B: length 18.9
  Top Layer w0.152: U7.7 v3(3.27,38.74)
  Top Layer w0.254: R7.1 v3(2.29,54.5)
  Bottom Layer w0.254: v3(2.29,54.5) 3.3,53.49 3.3,38.77 v3(3.27,38.74)
SWCLK: length 18.5
  Top Layer w0.152: U2.37 8.32,18.22 v3(8.39,18.16)
  Bottom Layer w0.152: H2.2 11.94,5.29 11.94,5.81 6.34,11.41 6.34,14.52 8,16.18 8,16.22 8.19,16.41 8.19,17.96 v3(8.39,18.16)
SWIO: length 21
  Top Layer w0.152: v3(9.51,18.29) 9.58,18.36 U2.34
  Bottom Layer w0.152: H2.1 13.73,6.04 12.07,6.04 6.59,11.52 6.59,14.42 8.44,16.27 8.44,17.23 v3(9.51,18.29)
SYS_RGB: length 116.3
  Top Layer w0.152: U2.6 11.08,12.09 11.94,12.95 11.94,14.61 11.05,15.49 9.53,15.49 8.44,16.57 8.44,17.21 8.98,17.74 8.98,18.33 8.62,18.69 6.62,18.69 v3(6.48,18.84) ; v3(7.04,80.55) 6.18,81.41 2.05,81.41 1.14,82.31 1.14,90.04 1.78,90.68 4.7,90.68 5.21,91.19 5.21,95.89 4.29,96.8 4.29,97.09
  Bottom Layer w0.152: v3(6.48,18.84) 6.48,16.5 5.07,15.09 5.07,13.45 4.69,13.07 3.75,13.07 2.04,14.78 2.04,18.03 6.74,22.73 6.74,27.06 7.93,28.25 7.93,55.34 7.05,56.22 7.05,80.54 v3(7.04,80.55)
$1N1340: length 5.6
  Top Layer w0.152: 2.41,44.77 2.73,44.45 3.11,44.45 4.32,43.24 D3.2 4.32,42.93 5.81,41.44 U7.5
$1N2752: length 11.4
  Top Layer w0.508: L1.1 18.75,41.07 18.47,41.35 14.07,41.35 13.72,41.71 13.72,42.42
$1N2756: length 2.4
  Top Layer w0.254: C5.1 16.96,40.25 U1.6
$1N6554: length 4.7
  Top Layer w0.254: U1.4 12.75,40.23 R2.2 R1.1
$1N17664: length 3.5
  Top Layer w0.508: U8.7 15.26,82.32 16.17,83.23 R3.1
$1N17864: length 3.7
  Top Layer w0.508: R4.1 16.3,74.97 15.39,74.06 14.88,74.06
$1N18070: length 3.6
  Top Layer w0.508: U10.7 15.14,65.94 16.05,66.85 R5.1
$1N18276: length 3.7
  Top Layer w0.508: R6.1 16.05,58.72 15.14,57.81 U11.7
$1N22933: length 45.1
  Top Layer w0.254: v3(3.04,59.7) 2.22,58.89 2.22,57.22 R9.2 2.29,56.89 R7.2
  Bottom Layer w0.254: CN1.1 13.38,89.79 7.94,89.79 5.69,87.54 5.69,62.36 5.25,61.92 arc(5.02,61.82) 4.8,61.92 4.6,62.12 arc(4.15,62.12) 4.15,61.67 4.35,61.47 arc(4.35,61.02) 3.9,61.02 3.7,61.22 arc(3.25,61.22) 3.25,60.77 3.45,60.57 arc(3.55,60.34) 3.45,60.12 v3(3.04,59.7)
$1N22936: length 45.1
  Top Layer w0.254: R8.2 4.06,56.89 R9.1 4.12,57.22 D2.2 4.19,58.78 v3(4.19,59.94)
  Bottom Layer w0.254: CN1.3 15.12,88.53 12.46,88.53 11.6,89.38 8.11,89.38 6.1,87.37 6.1,61.85 v3(4.19,59.94)
$1N32139: length 3.7
  Top Layer w0.152: R11.2 R10.2 4.39,50.3 4.39,48.83
$1N32182: length 8.2
  Top Layer w0.152: 1.67,43.37 1.65,43.37 1.65,47.44 Q1.3 ; 1.67,43.37 C17.2 ; 1.67,43.37 1.65,43.35 1.65,42.42 2,42.07 U7.8
$1N32717: length 21.2
  Top Layer w1.016: CN1.4 18.29,88.69 18.29,90.55 17.27,91.57 10.64,91.57 7.91,88.84 D4.1 6.78,88.82 D1.2

## Copper pours and planes (outline as drawn; the poured copper is in the pictures)
3.3V on Top Layer: 7.61,37.85 13.93,37.85 13.93,31.9 7.61,31.9
24V on Top Layer: 10.16,47.63 13.31,47.63 13.31,42.02 10.16,42.02
GND on Top Layer: 9.76,34.69 20.01,34.69 20.01,29.06 9.76,29.06
GND on Top Layer: 7.71,43.75 13.08,43.75 13.08,39.8 7.71,39.8
GND on Top Layer: -15.24,118.11 50.8,118.11 50.8,-13.46 -15.24,-13.46
GND on Top Layer: 13.87,47.66 16.73,47.66 16.73,42.01 13.87,42.01
GND on Top Layer: 15.65,44.83 18.29,44.83 18.29,42.16 15.65,42.16
GND on Top Layer: 6.64,43.14 8.56,43.14 8.56,41.79 6.64,41.79
GND on Top Layer: 6.77,36.99 8.55,36.99 8.55,35.88 6.77,35.88
GND on Bottom Layer: -8.25,106.68 48.26,106.68 48.26,-10.41 -8.25,-10.41
$1N2752 on Top Layer: 13.45,43.09 19.35,43.09 19.35,37.06 13.45,37.06
$1N2756 on Top Layer: 14.59,40.48 17.02,40.48 17.02,39.99 14.59,39.99
$1N6554 on Top Layer: 9.47,40.44 12.73,40.44 12.73,40.03 9.47,40.03

Small or netless copper shapes (teardrops, artwork), in the pictures only: 473 on Top Layer, 144 on Bottom Layer

## Text on the board
Bottom Silkscreen Layer: Tx Rx / V+ GND | IO CLK / ETxERx | GND 24V / B   A
Top Silkscreen Layer: R T / - + | + | B | R | 4 | 3 | 2 | 1
